# EAGLE schematic carcomputer_split1_top (EAGLE 9.3.2)
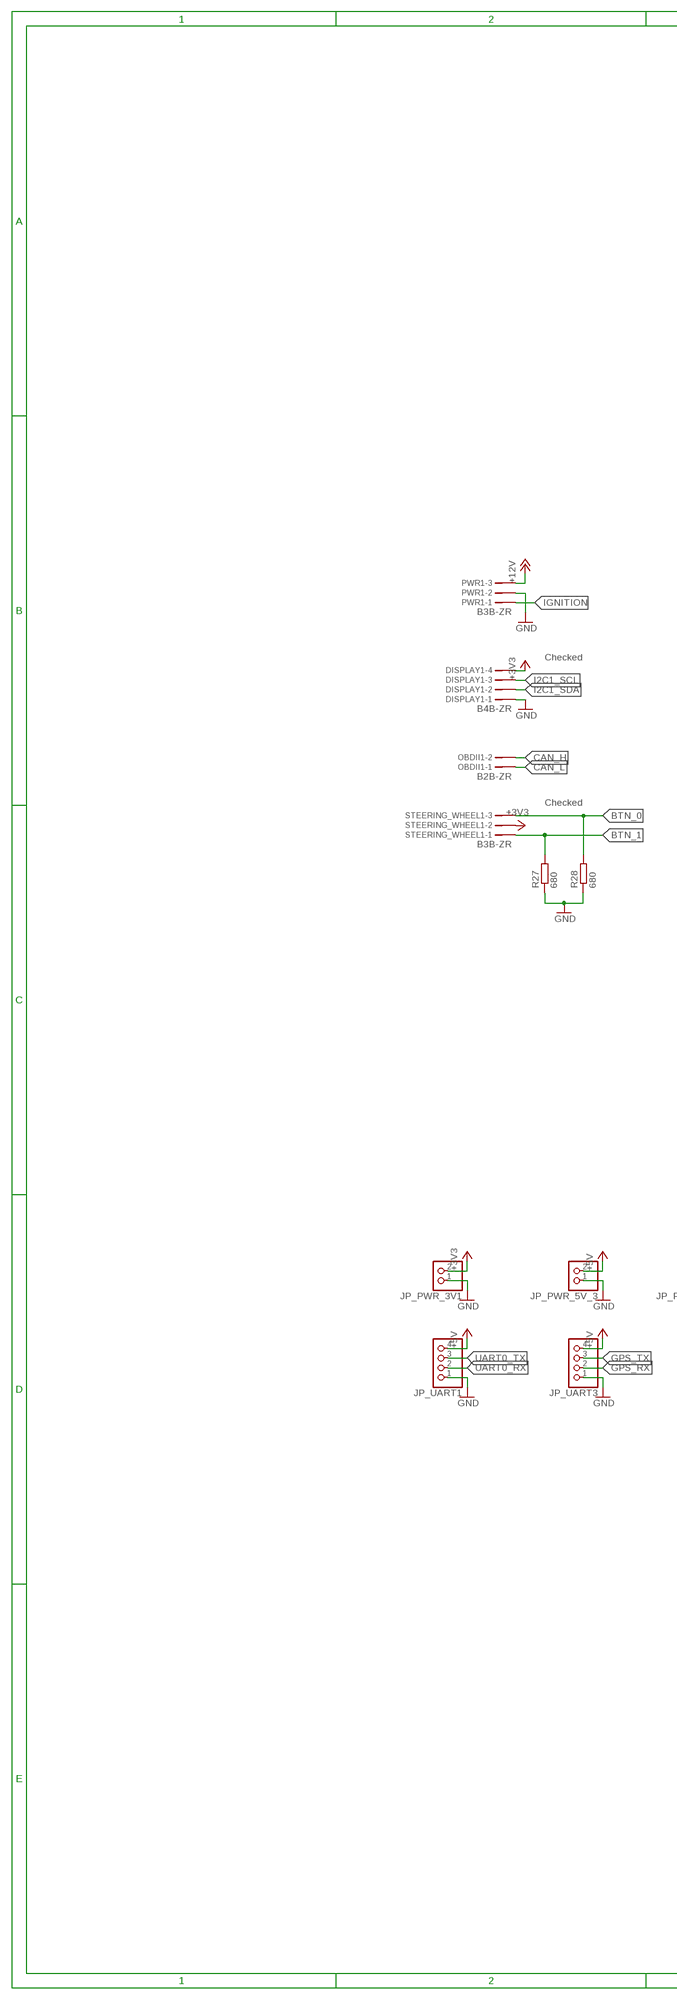
[diagram p0: schematic, sheet 1, part 1 of 2]
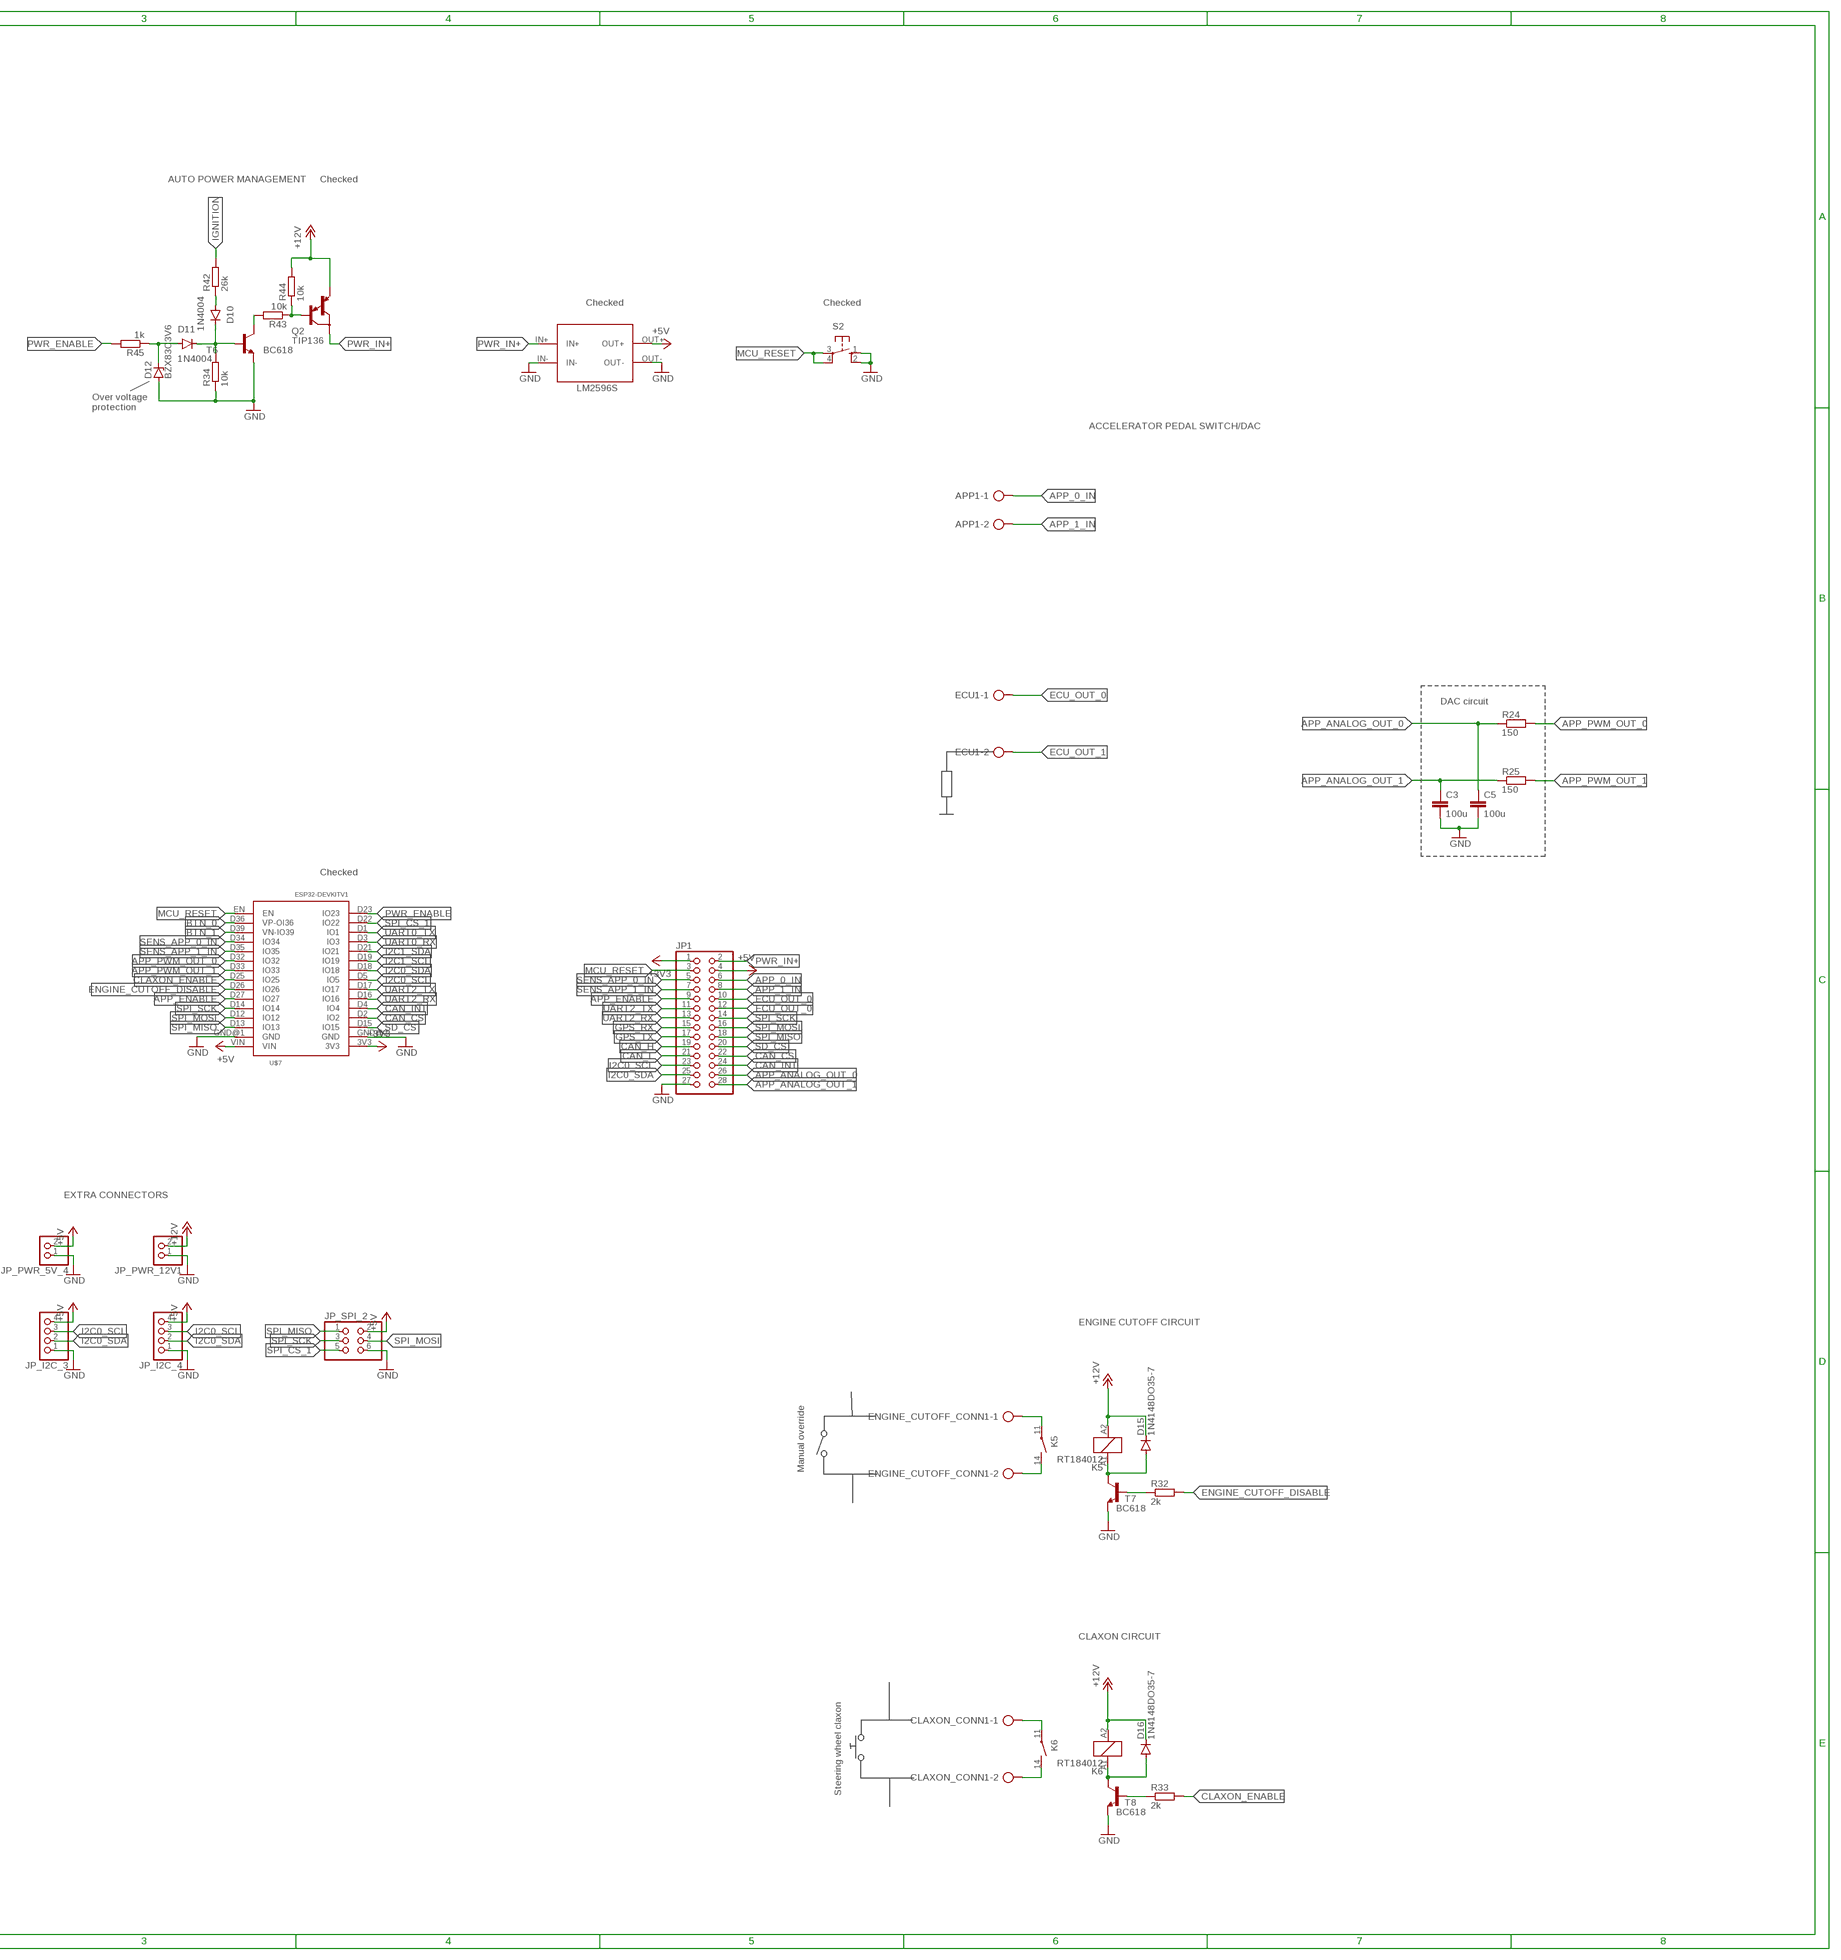
[diagram p1: schematic, sheet 1, part 2 of 2]

## Parts
APP1  AK300/2  [AK300/2]
C3  100u  C-EU025-050X050  [C025-050X050]
C5  100u  C-EU025-050X050  [C025-050X050]
CLAXON_CONN1  AK300/2  [AK300/2]
D10  1N4004  [DO41-10]
D11  1N4004  [DO41-10]
D12  BZX83C3V6  BZX85  [DO41Z10]
D15  1N4148DO35-7  [DO35-7]
D16  1N4148DO35-7  [DO35-7]
DISPLAY1  B4B-ZR  [B4B-ZR]
ECU1  AK300/2  [AK300/2]
ENGINE_CUTOFF_CONN1  AK300/2  [AK300/2]
JP1  PINHD-2X14  [2X14]
JP_I2C_3  PINHD-1X4  [1X04]
JP_I2C_4  PINHD-1X4  [1X04]
JP_PWR_3V1  PINHD-1X2  [1X02]
JP_PWR_5V_3  PINHD-1X2  [1X02]
JP_PWR_5V_4  PINHD-1X2  [1X02]
JP_PWR_12V1  PINHD-1X2  [1X02]
JP_SPI_2  PINHD-2X3  [2X03]
JP_UART1  PINHD-1X4  [1X04]
JP_UART3  PINHD-1X4  [1X04]
K5  RT184012  [RT-N/O12A3.5]
K6  RT184012  [RT-N/O12A3.5]
OBDII1  B2B-ZR  [B2B-ZR]
PWR1  B3B-ZR  [B3B-ZR]
Q2  TIP136  [TO220]
R24  150  R-EU_0207/7  [0207/7]
R25  150  R-EU_0207/7  [0207/7]
R27  680  R-EU_0207/7  [0207/7]
R28  680  R-EU_0207/7  [0207/7]
R32  2k  R-EU_0207/7  [0207/7]
R33  2k  R-EU_0207/7  [0207/7]
R34  10k  R-EU_0207/7  [0207/7]
R42  26k  R-EU_0207/7  [0207/7]
R43  10k  R-EU_0207/7  [0207/7]
R44  10k  R-EU_0207/7  [0207/7]
R45  1k  R-EU_0207/7  [0207/7]
S2  10-XX  [B3F-10XX]
STEERING_WHEEL1  B3B-ZR  [B3B-ZR]
T6  BC618  [TO92-EBC]
T7  BC618  [TO92-EBC]
T8  BC618  [TO92-EBC]
U$7  ESP32DEVKITV1  [ESP32-DEVKITV1]
U$10  LM2596S  [LM2596S]

## Nets
+3V3: DISPLAY1.4 JP1.1 JP_PWR_3V1.2 STEERING_WHEEL1.2 U$7.3V3
+5V: JP1.4 JP_I2C_3.4 JP_I2C_4.4 JP_PWR_5V_3.2 JP_PWR_5V_4.2 JP_SPI_2.2 JP_UART1.4 JP_UART3.4 U$7.VIN U$10.OUT+
+12V: D15.C D16.C JP_PWR_12V1.2 K5.A2 K6.A2 PWR1.3 Q2.3(E) R44.2
APP_0_IN: APP1.1 JP1.6
APP_1_IN: APP1.2 JP1.8
APP_ANALOG_OUT_0: C5.1 JP1.26 R24.1
APP_ANALOG_OUT_1: C3.1 JP1.28 R25.1
APP_ENABLE: JP1.9 U$7.D27(IO27)
APP_PWM_OUT_0: R24.2 U$7.D32(IO32)
APP_PWM_OUT_1: R25.2 U$7.D33(IO33)
BTN_0: R28.2 STEERING_WHEEL1.3 U$7.D36(VP-OI36)
BTN_1: R27.2 STEERING_WHEEL1.1 U$7.D39(VN-IO39)
CAN_CS: JP1.22 U$7.D2(IO2)
CAN_H: JP1.19 OBDII1.2
CAN_INT: JP1.24 U$7.D4(IO4)
CAN_L: JP1.21 OBDII1.1
CLAXON_ENABLE: R33.2 U$7.D25(IO25)
ECU_OUT_0: ECU1.1 JP1.10 JP1.12
ECU_OUT_1: ECU1.2
ENGINE_CUTOFF_DISABLE: R32.2 U$7.D26(IO26)
GND: C3.2 C5.2 D12.A DISPLAY1.1 JP1.27 JP_I2C_3.1 JP_I2C_4.1 JP_PWR_3V1.1 JP_PWR_5V_3.1 JP_PWR_5V_4.1 JP_PWR_12V1.1 JP_SPI_2.6 JP_UART1.1 JP_UART3.1 PWR1.2 R27.1 R28.1 R34.1 S2.1(S) S2.2(S1) T6.E T7.E T8.E U$7.GND@1(GND) U$7.GND@2(GND) U$10.IN- U$10.OUT-
GPS_RX: JP1.15 JP_UART3.2
GPS_TX: JP1.17 JP_UART3.3
I2C0_SCL: JP1.23 JP_I2C_3.3 JP_I2C_4.3 U$7.D5(IO5)
I2C0_SDA: JP1.25 JP_I2C_3.2 JP_I2C_4.2 U$7.D18(IO18)
I2C1_SCL: DISPLAY1.3 U$7.D19(IO19)
I2C1_SDA: DISPLAY1.2 U$7.D21(IO21)
IGNITION: PWR1.1 R42.2
MCU_RESET: JP1.3 S2.3(P) S2.4(P1) U$7.EN
N$33: D10.C D11.C R34.2 T6.B
N$35: D10.A R42.1
N$36: Q2.1(B) R43.1 R44.1
N$37: R43.2 T6.C
N$38: D11.A D12.C R45.1
N$45: D15.A K5.A1 T7.C
N$46: R32.1 T7.B
N$47: ENGINE_CUTOFF_CONN1.1 K5.11(2:P)
N$48: ENGINE_CUTOFF_CONN1.2 K5.14(2:S)
N$49: D16.A K6.A1 T8.C
N$50: R33.1 T8.B
N$51: CLAXON_CONN1.1 K6.11(2:P)
N$52: CLAXON_CONN1.2 K6.14(2:S)
PWR_ENABLE: R45.2 U$7.D23(IO23)
PWR_IN+: JP1.2 Q2.2(C) U$10.IN+
SD_CS: JP1.20 U$7.D15(IO15)
SENS_APP_0_IN: JP1.5 U$7.D34(IO34)
SENS_APP_1_IN: JP1.7 U$7.D35(IO35)
SPI_CS_1: JP_SPI_2.5 U$7.D22(IO22)
SPI_MISO: JP1.18 JP_SPI_2.1 U$7.D13(IO13)
SPI_MOSI: JP1.16 JP_SPI_2.4 U$7.D12(IO12)
SPI_SCK: JP1.14 JP_SPI_2.3 U$7.D14(IO14)
UART0_RX: JP_UART1.2 U$7.D3(IO3)
UART0_TX: JP_UART1.3 U$7.D1(IO1)
UART2_RX: JP1.13 U$7.D16(IO16)
UART2_TX: JP1.11 U$7.D17(IO17)

## Notes on the sheet
- AUTO POWER MANAGEMENT | Checked
- Checked | Checked
- Over voltage
  protection
- ACCELERATOR PEDAL SWITCH/DAC
- Checked
- DAC circuit
- Checked
- Checked
- EXTRA CONNECTORS
- ENGINE CUTOFF CIRCUIT
- Manual override
- CLAXON CIRCUIT
- Steering wheel claxon

## Library data of the parts
APP1 CLAXON_CONN1 ECU1 ENGINE_CUTOFF_CONN1 = con-ptr500-custom:AK300/2: CONNECTOR; OC_FARNELL: unknown; OC_NEWARK: unknown
C3 C5 = rcl:C-EU: CAPACITOR, European symbol; SPICEPREFIX: C
D10 D11 = diode:1N4004: DIODE general purpose rectifier, 1 A
D12 = diode:BZX85: Z DIODE
D15 D16 = diode:1N4148: DIODE high speed (Philips)
DISPLAY1 = con-jst-custom:?4B-ZR: ZH CONNECTOR 1.5 mm, 4 pin 1 row Source: http://www.jst.com .. eZH.pdf; MF: FARNELL; MPN: B4B-ZR(LF)(SN); OC_FARNELL: 1830916; OC_NEWARK: 37K9960
JP1 = pinhead:PINHD-2X14: PIN HEADER
JP_I2C_3 JP_I2C_4 JP_UART1 JP_UART3 = pinhead:PINHD-1X4: PIN HEADER
JP_PWR_3V1 JP_PWR_5V_3 JP_PWR_5V_4 JP_PWR_12V1 = pinhead:PINHD-1X2: PIN HEADER
JP_SPI_2 = pinhead:PINHD-2X3: PIN HEADER
K5 K6 = relay:RT?*: Power PCB Relay SCHRACK 1 pole 12 / 16 A, DC- or AC-coil Source: http://www.schrack.com/.. 5819.pdf; MF: TYCO ELECTRONICS; MPN: RT184012; OC_FARNELL: unknown; OC_NEWARK: 08H3731
OBDII1 = con-jst-custom:?2B-ZR: ZH CONNECTOR 1.5 mm, 4 pin 1 row Source: http://www.jst.com .. eZH.pdf
PWR1 STEERING_WHEEL1 = con-jst-custom:?3B-ZR: ZH CONNECTOR 1.5 mm, 4 pin 1 row Source: http://www.jst.com .. eZH.pdf
Q2 = transistor-pnp:TIP136: PNP Darlington Transistor
R24 R25 R27 R28 R32-R34 R42-R45 = rcl:R-EU_: RESISTOR, European symbol; SPICEPREFIX: R
S2 = switch-omron:10-XX: OMRON SWITCH; MPN: B3F-1000; OC_FARNELL: 176432; OC_NEWARK: 36M3542
T6-T8 = transistor-npn:BC618*: NPN Transistor
U$7 = ESP32-DEVKITV1:ESP32DEVKITV1
U$10 = PSU:LM2596S